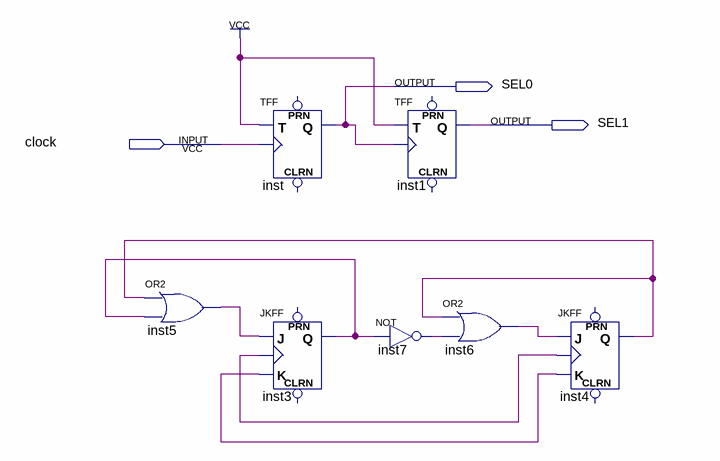
[diagram p0: schematic sheet]
// Quartus schematic seletor2.bdf as structural Verilog: 7 symbols, 3 pins
module seletor2 (
  input  clock,
  output SEL0,
  output SEL1
);

  wire inst3_q, inst4_q, inst5_out, inst6_out, inst7_out, undriven, undriven_2;

  or inst5 (inst5_out, inst4_q, inst3_q);
  TFF inst (.T(1'b1), .CLK(clock), .Q(SEL0));  // open: PRN, CLRN
  JKFF inst3 (.K(undriven), .J(inst5_out), .CLK(undriven_2), .Q(inst3_q));  // open: PRN, CLRN
  not inst7 (inst7_out, inst3_q);
  TFF inst1 (.T(1'b1), .CLK(SEL0), .Q(SEL1));  // open: PRN, CLRN
  or inst6 (inst6_out, inst4_q, inst7_out);
  JKFF inst4 (.K(undriven), .J(inst6_out), .CLK(undriven_2), .Q(inst4_q));  // open: PRN, CLRN
endmodule
